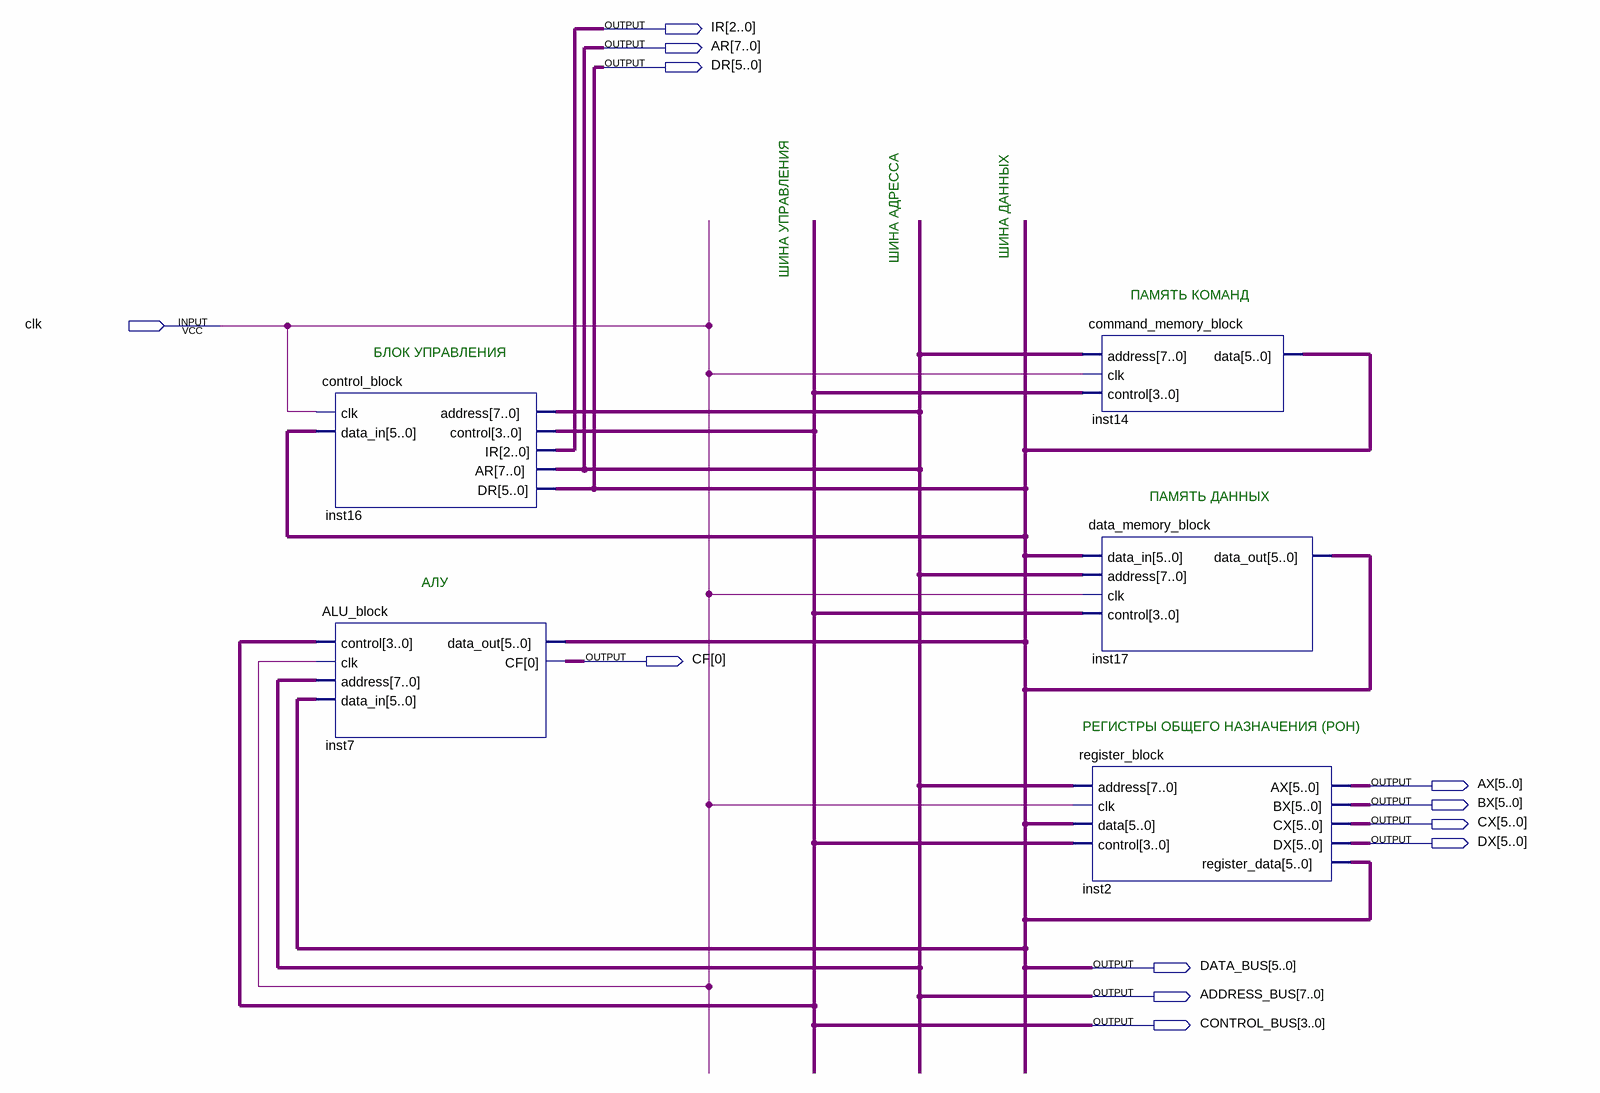
[diagram p0: schematic sheet]
// Quartus schematic main_block.bdf as structural Verilog: 5 symbols, 12 pins
module main_block (
  input  clk,
  output [2:0] IR,
  output [7:0] AR,
  output [5:0] DR,
  output [0:0] CF,
  output [5:0] AX,
  output [5:0] BX,
  output [5:0] CX,
  output [5:0] DX,
  output [5:0] DATA_BUS,
  output [7:0] ADDRESS_BUS,
  output [3:0] CONTROL_BUS
);

  control_block inst16 (
    .clk(clk), .data_in(DATA_BUS), .address(ADDRESS_BUS), .control(CONTROL_BUS), .IR(IR), .AR(ADDRESS_BUS),
    .DR(DATA_BUS));
  ALU_block inst7 (
    .control(CONTROL_BUS), .clk(clk), .address(ADDRESS_BUS), .data_in(DATA_BUS), .data_out(DATA_BUS),
    .CF(CF[0]));
  command_memory_block inst14 (.address(ADDRESS_BUS), .clk(clk), .control(CONTROL_BUS), .data(DATA_BUS));
  data_memory_block inst17 (
    .data_in(DATA_BUS), .address(ADDRESS_BUS), .clk(clk), .control(CONTROL_BUS), .data_out(DATA_BUS));
  register_block inst2 (
    .address(ADDRESS_BUS), .clk(clk), .data(DATA_BUS), .control(CONTROL_BUS), .AX(AX), .BX(BX), .CX(CX),
    .DX(DX), .register_data(DATA_BUS));

  assign AR = ADDRESS_BUS;
  assign DR = DATA_BUS;

  // Notes on the sheet:
  //   ШИНА УПРАВЛЕНИЯ
  //   ШИНА АДРЕССА
  //   ШИНА ДАННЫХ
  //   ПАМЯТЬ КОМАНД
  //   БЛОК УПРАВЛЕНИЯ
  //   ПАМЯТЬ ДАННЫХ
  //   АЛУ
  //   РЕГИСТРЫ ОБЩЕГО НАЗНАЧЕНИЯ (РОН)
endmodule
